# EAGLE board RectangularThing-SOICs-TWEAKS (EAGLE 7.7.0), part 1 of 2
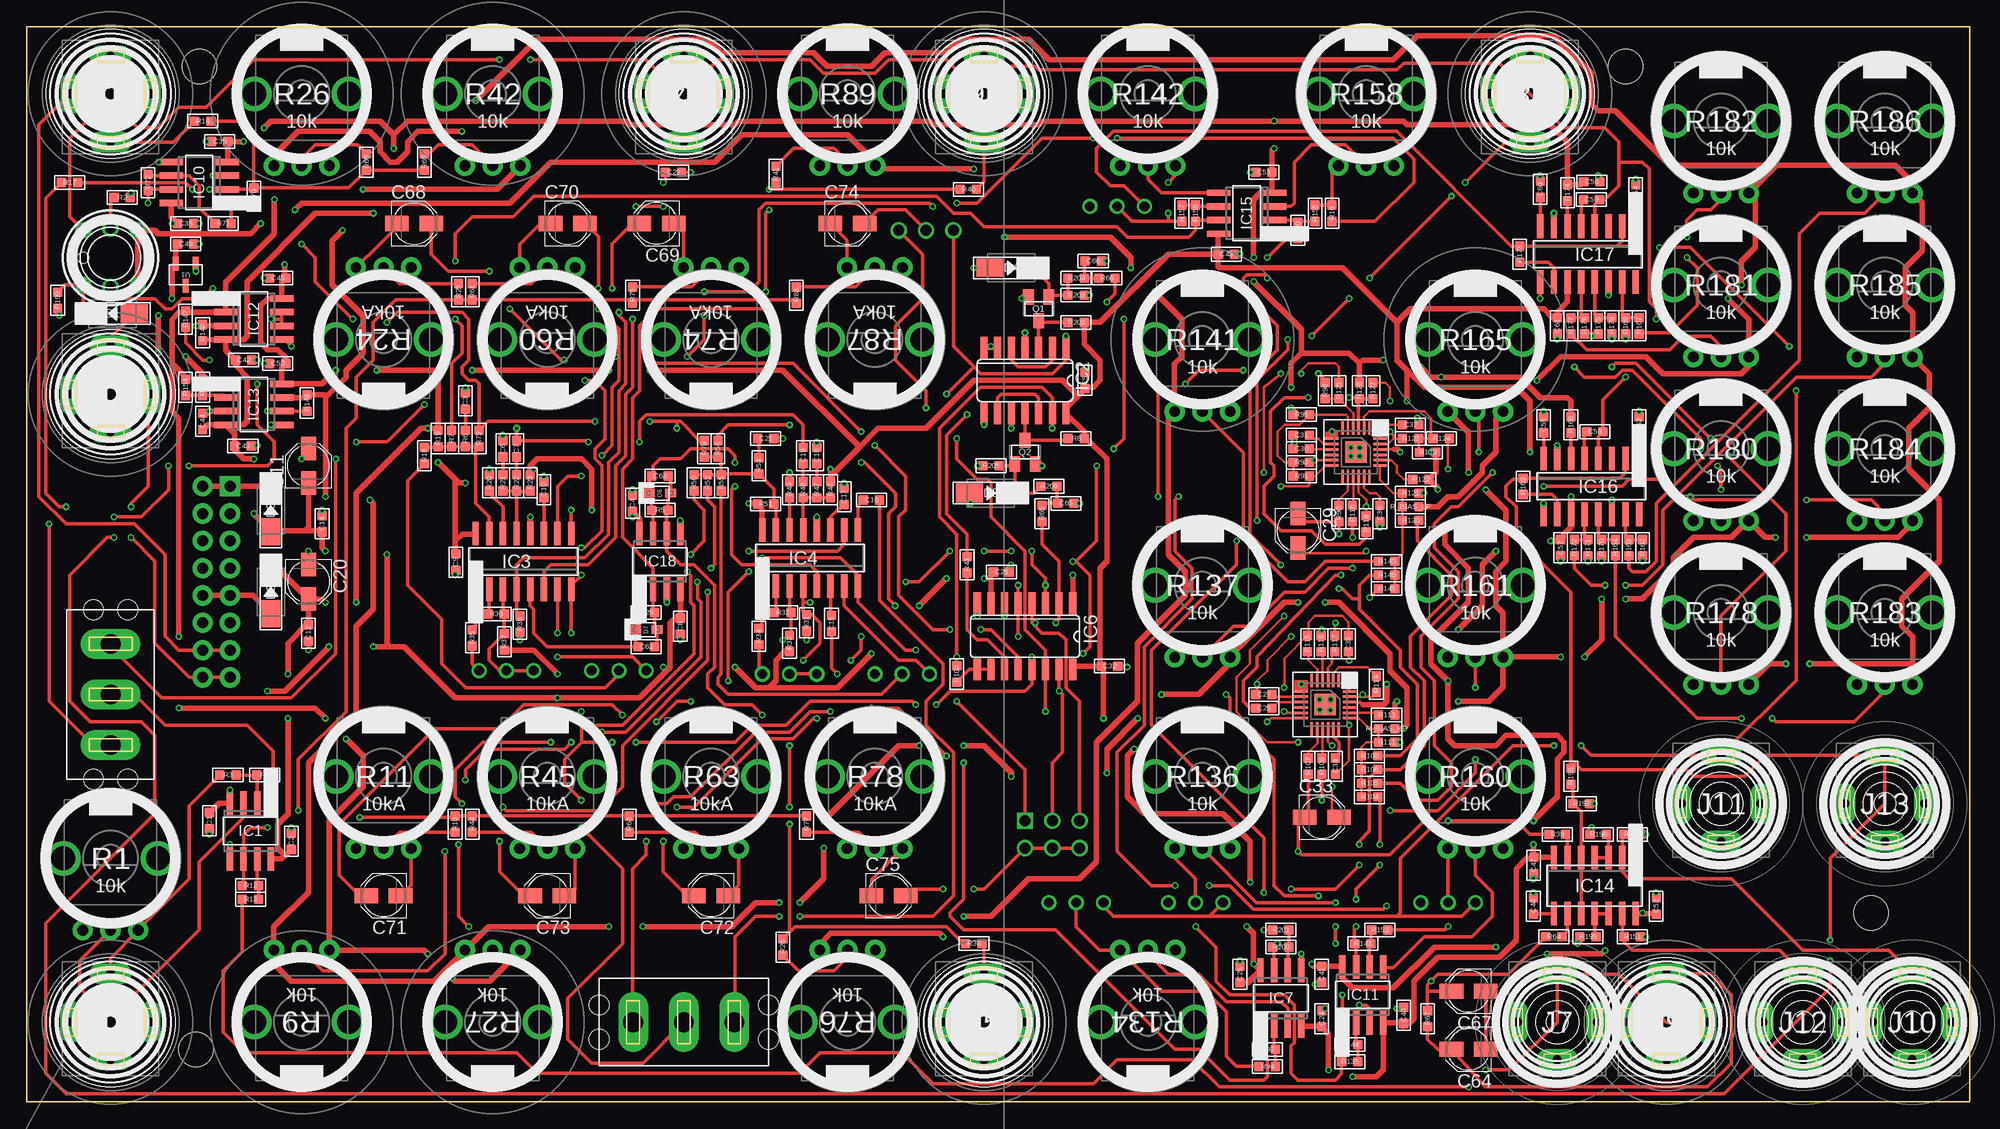
[diagram p10: board, top side]
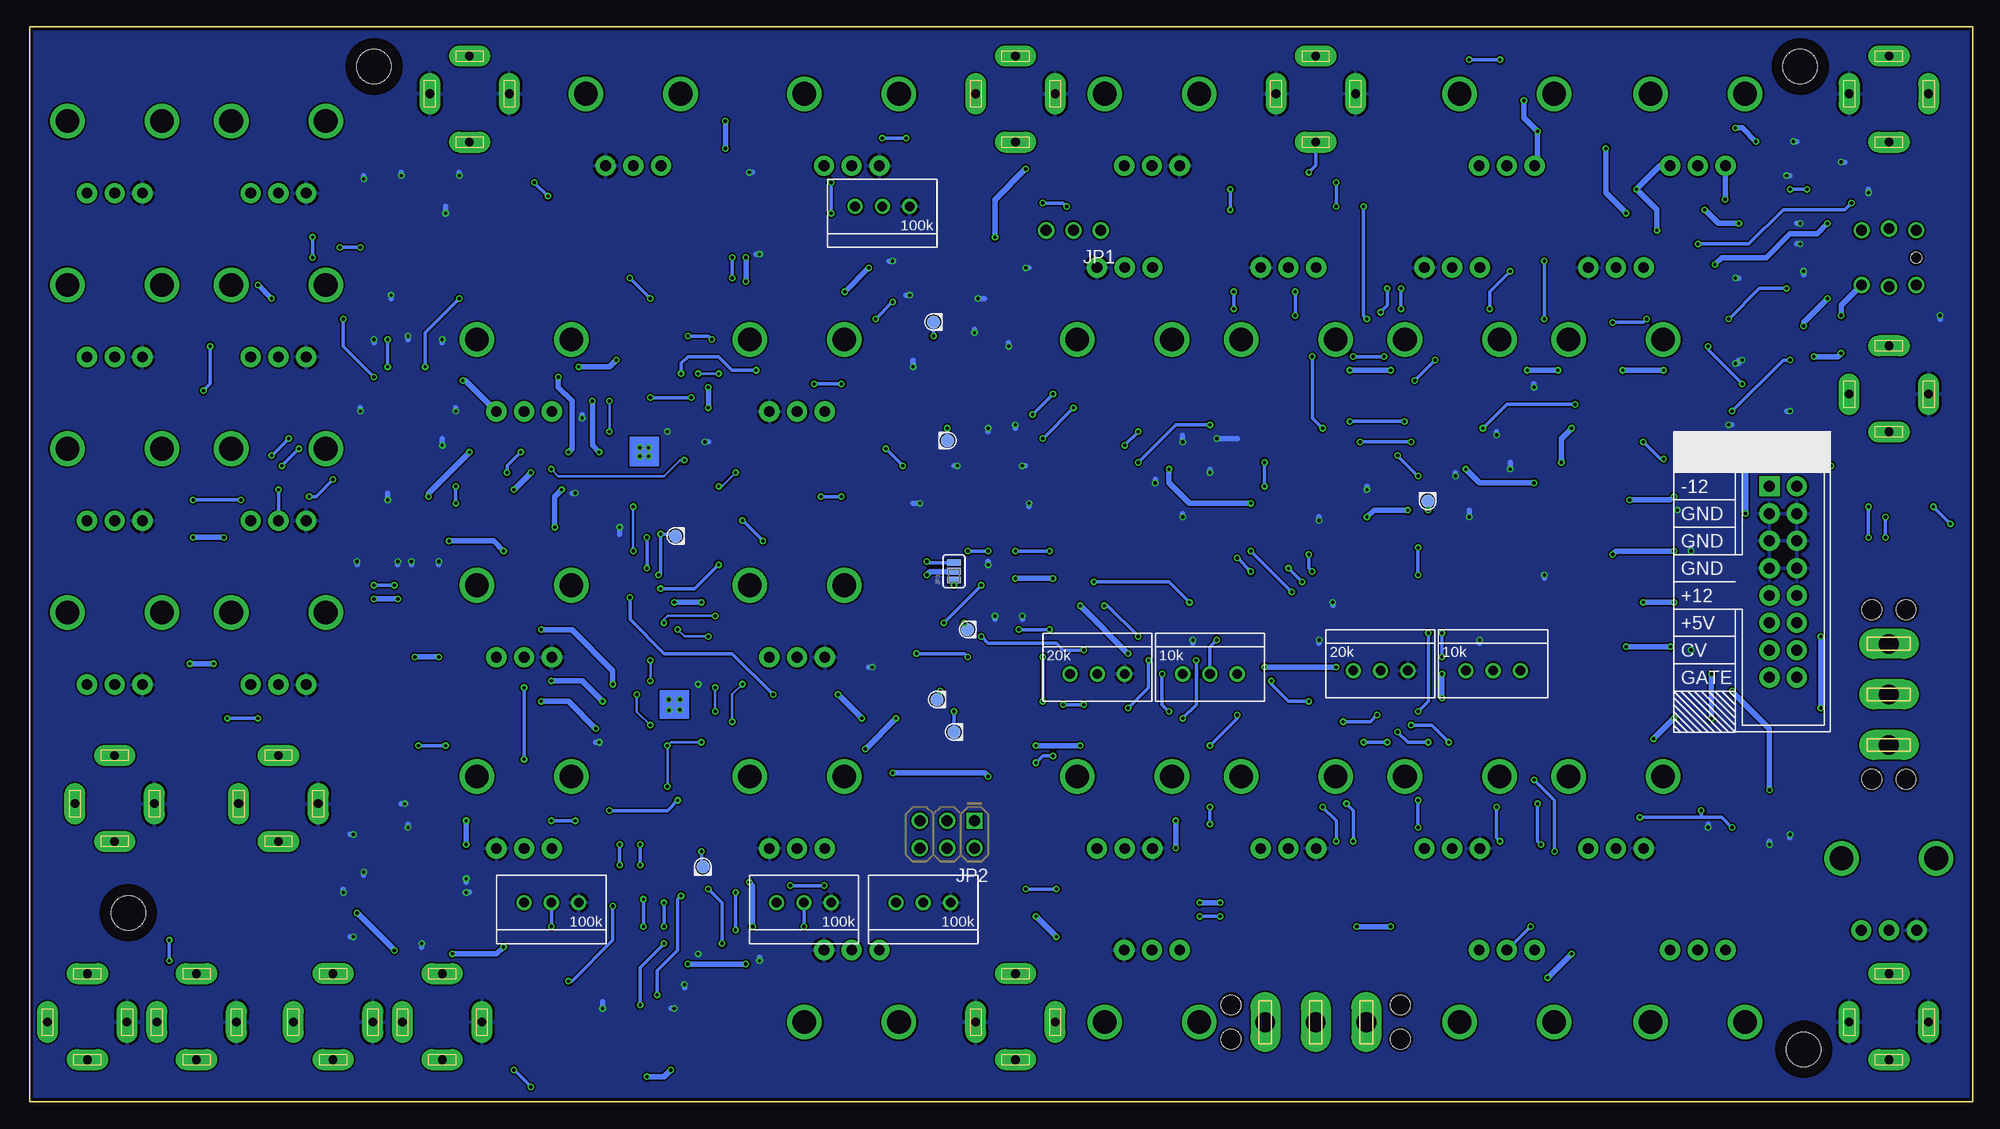
[diagram p11: board, bottom side, seen from below]

Size 180.78 x 100 mm. Coordinates in mm from the lower left corner, seen from the top.
Copper layers (1*16): Top 0.035mm / dielectric 1.5mm / Bottom 0.035mm
Design rules "ITEADstudio_DRC": minimum track width 6mil, minimum drill 12mil, track to track 6mil, track to pad 6mil, pad to pad 6mil, via to via 6mil, smd to smd 0mil, copper to edge 10mil, drill to drill 10mil, minimum pad ring 10mil, minimum via ring 6mil, stop-mask expansion 2mil, vias tented up to drill 100mil, thermal gap 10mil
Net classes: 0 default: width 0.305 mm; 1 power: width 0.508 mm; 2 nearfilter: width 0.254 mm; 3 groundplane: width 0.203 mm, clearance 0.203 mm

## Footprints (pad centres in the part's own frame; a part is rotated, then mirrored left to right if it is on the bottom)
C0603 = smd 0.889 x 0.889: 1 -0.762,0; 2 0.762,0
CASE_B = smd 2.2 x 1.4: + 1.6,0; - -1.6,0
DO-214AC = smd 2.5 x 1.7: 1 -2,0; 2 2,0
SOD-323F = smd 1 x 0.8: A -1,0; C 1,0
3.2-NOMARKINGS-SMALLSAFEZONE = hole 3.2: 0,0
SO08 = smd 0.6 x 2.2: 1 -1.905,-2.6; 2 -0.635,-2.6; 3 0.635,-2.6; 4 1.905,-2.6; 5 1.905,2.6; 6 0.635,2.6; 7 -0.635,2.6; 8 -1.905,2.6
SO14 = smd 0.66 x 2.032: 1 -3.81,-3.073; 2 -2.54,-3.073; 3 -1.27,-3.073; 4 0,-3.073; 5 1.27,-3.073; 6 2.54,-3.073; 7 3.81,-3.073; 8 3.81,3.073; 9 2.54,3.073; 10 1.27,3.073; 11 0,3.073; 12 -1.27,3.073; 13 -2.54,3.073; 14 -3.81,3.073
SO16 = smd 0.6 x 2.2: 1 -4.445,-2.6; 2 -3.175,-2.6; 3 -1.905,-2.6; 4 -0.635,-2.6; 5 0.635,-2.6; 6 1.905,-2.6; 7 3.175,-2.6; 8 4.445,-2.6; 9 4.445,2.6; 10 3.175,2.6; 11 1.905,2.6; 12 0.635,2.6; 13 -0.635,2.6; 14 -1.905,2.6; 15 -3.175,2.6; 16 -4.445,2.6
SO16' = smd 0.66 x 2.032: 1 -4.445,-3.073; 2 -3.175,-3.073; 3 -1.905,-3.073; 4 -0.635,-3.073; 5 0.635,-3.073; 6 1.905,-3.073; 7 3.175,-3.073; 8 4.445,-3.073; 9 4.445,3.073; 10 3.175,3.073; 11 1.905,3.073; 12 0.635,3.073; 13 -0.635,3.073; 14 -1.905,3.073; 15 -3.175,3.073; 16 -4.445,3.073
QFN24 = smd 1.25 x 0.23: P$1 -2.25,1.25; P$2 -2.25,0.75; P$3 -2.25,0.25; P$4 -2.25,-0.25; P$5 -2.25,-0.75; P$6 -2.25,-1.25; P$13 2.25,-1.25; P$14 2.25,-0.75; P$15 2.25,-0.25; P$16 2.25,0.25; P$17 2.25,0.75; P$18 2.25,1.25 | smd 0.23 x 1.25: P$7 -1.25,-2.25; P$8 -0.75,-2.25; P$9 -0.25,-2.25; P$10 0.25,-2.25; P$11 0.75,-2.25; P$12 1.25,-2.25; P$19 1.25,2.25; P$20 0.75,2.25; P$21 0.25,2.25; P$22 -0.25,2.25; P$23 -0.75,2.25; P$24 -1.25,2.25 | smd 2 x 2: PAD 0,0
SO14' = smd 0.6 x 2.2: 1 -3.81,-2.6; 2 -2.54,-2.6; 3 -1.27,-2.6; 4 0,-2.6; 5 1.27,-2.6; 6 2.54,-2.6; 7 3.81,-2.6; 8 3.81,2.6; 9 2.54,2.6; 10 1.27,2.6; 11 0,2.6; 12 -1.27,2.6; 13 -2.54,2.6; 14 -3.81,2.6
3.5MM-JACK-SWITCH-13MM-INPUT = drill 0.8 pad 1.93 long: RING@3 -3.7,0; SECOND@3 0,-3.5; SWITCH@3 3.7,0; TIP@3 0,4.5
3.5MM-JACK-SWITCH-13MM-OUTPUT = drill 0.8 pad 1.93 long: RING@3 -3.7,0; SECOND@3 0,-3.5; SWITCH@3 3.7,0; TIP@3 0,4.5
POWER_16_SHROUDED = drill 1.016 pad 1.88 square: 1 -8.89,-1.27 | drill 1.016 pad 1.88: 2 -8.89,1.27; 3 -6.35,-1.27; 4 -6.35,1.27; 5 -3.81,-1.27; 6 -3.81,1.27; 7 -1.27,-1.27; 8 -1.27,1.27; 9 1.27,-1.27; 10 1.27,1.27; 11 3.81,-1.27; 12 3.81,1.27; 13 6.35,-1.27; 14 6.35,1.27; 15 8.89,-1.27; 16 8.89,1.27
1X03_NO_SILK = drill 1.016: 1 0,0; 2 2.54,0; 3 5.08,0
2X3-NS = drill 1.016 square: 1 -2.54,-1.27 | drill 1.016: 2 -2.54,1.27; 3 0,-1.27; 4 0,1.27; 5 2.54,-1.27; 6 2.54,1.27
SJ_3_PASTE1&2 = smd 0.635 x 1.27: 1 -0.813,0; 2 0,0; 3 0.813,0
SOT23-BEC = smd 1 x 1.4: B -0.95,-1.1; C 0,1.1; E 0.95,-1.1
OG-POTS_ALPS_POT_VERTICAL = drill 1 pad 1.88: P$1 -2.58,-6.7; P$2 0,-6.7; P$3 2.58,-6.7 | drill 2.2 pad 3.175: P$4 4.4,0; P$5 -4.4,0
R0603 = smd 0.889 x 0.889: 1 -0.762,0; 2 0.762,0
OG-POTS_ALPS_POT_VERTICAL_WITHBIGKNOB = drill 1 pad 1.88: P$1 -2.58,-6.7; P$2 0,-6.7; P$3 2.58,-6.7 | drill 2.2 pad 3.175: P$4 4.4,0; P$5 -4.4,0
TRIMPOT = drill 0.9: P$1 -2.54,0; P$2 0,0; P$3 2.54,0
MULTICOMP1MS-ONOFFON = drill 1.85 long: 1 -4.7,0; 2 0,0; 3 4.7,0 | hole 1.85: -7.875,1.59; -7.875,-1.59; 7.875,1.59; 7.875,-1.59
PB6149L = drill 1: 1 2.54,2.54; 2 2.54,-2.54; 3 -2.54,2.54; 4 -2.54,-2.54; LEDNEG 0,-2.7; LEDPOS 0,2.7 | hole 1: 2.54,0
PAD.03X.05 = smd 1.27 x 1.27: P$1 0,0
SOT95P237X112-3N = smd 1.321 x 0.559: 1 -1.016,0.94; 2 -1.016,-0.94; 3 1.016,0

## Placement (x,y rotation side)
C1  100nF  [C0603]  17,26.15 270 top
C2  100nF  [C0603]  24.62,24.24 270 top
C3  10nF  [C0603]  40.81,65.2 270 top
C4  100nF  [C0603]  56.37,55.67 270 top
C5  100nF  [C0603]  98.47,67.1 90 top
C6  10nF  [C0603]  44.3,60.75 270 top
C7  100nF  [C0603]  45.57,60.75 90 top
C8  100nF  [C0603]  60.81,44.24 90 top
C9  100nF  [C0603]  39.92,50.21 90 top
C10  1nF C0G  [C0603]  48.11,56.94 90 top
C11  10u  [CASE_B]  26.2,59.17 90 top
C12  100nF  [C0603]  26.2,43.61 270 top
C14  100nF  [C0603]  27.47,53.77 90 top
C15  1nF C0G  [C0603]  74.88,44.5 270 top
C16  1nF C0G  [C0603]  78.59,55.99 180 top
C17  1nF C0G  [C0603]  76.05,56.31 90 top
C18  10nF  [C0603]  73.51,60.12 270 top
C19  100nF  [C0603]  72.24,60.12 90 top
C20  10u  [CASE_B]  26.2,48.37 270 top
C21  10nF  [C0603]  68.75,61.71 180 top
C23  1nF C0G  [C0603]  60.18,86.47 0 top
C24  100nF  [C0603]  120.5,7.73 90 top
C25  100nF  [C0603]  90.69,49.29 180 top
C26  300pF  [C0603]  115.1,36.62 0 top
C27  300pF  [C0603]  115.1,37.89 180 top
C28  100nF  [C0603]  112.88,11.86 270 top
C29  1uF  [CASE_B]  118.28,53.13 270 top
C30  300pF  [C0603]  118.6,60.75 0 top
C31  300pF  [C0603]  118.6,62.02 0 top
C32  100nF  [C0603]  100.75,40.53 0 top
C33  1uF  [CASE_B]  120.5,26.46 0 top
C34  300pF  [C0603]  121.77,31.23 270 top
C35  300pF  [C0603]  122.98,42.62 90 top
C36  300pF  [C0603]  125.9,54.72 270 top
C37  300pF  [C0603]  128.76,62.98 0 top
C38  100nF  [C0603]  14.77,81.71 180 top
C39  100nF  [C0603]  17.95,89.33 0 top
C40  100nF  [C0603]  128.12,8.05 90 top
C41  100nF  [C0603]  120.5,11.86 90 top
C42  100nF  [C0603]  20.17,69.01 0 top
C43  100nF  [C0603]  20.11,61.01 0 top
C44  100nF  [C0603]  16.36,63.29 90 top
C45  100nF  [C0603]  111.61,78.85 180 top
C46  5nF  [C0603]  140.19,18.21 90 top
C47  100nF  [C0603]  140.22,21.99 270 top
C48  100nF  [C0603]  23.35,76.63 0 top
C49  100nF  [C0603]  14.77,79.8 180 top
C50  100nF  [C0603]  23.35,68.69 0 top
C51  100nF  [C0603]  115.1,86.47 180 top
C52  100nF  [C0603]  151.62,18.21 270 top
C53  39nF  [C0603]  150.03,62.98 270 top
C54  39nF  [C0603]  149.71,84.57 270 top
C55  20nF  [C0603]  141.14,62.98 270 top
C56  10nF  [C0603]  145.9,62.34 180 top
C57  100nF  [C0603]  142.73,51.55 90 top
C58  100nF  [C0603]  145.61,85.58 180 top
C59  20nF  [C0603]  145.58,83.93 180 top
C60  20nF  [C0603]  140.82,84.88 270 top
C61  100nF  [C0603]  142.41,72.18 270 top
C62  10nF  [C0603]  57.64,42.34 0 top
C63  10nF  [C0603]  58.91,58.21 0 top
C64  10u  [CASE_B]  134.15,4.87 180 top
C65  33pF  [C0603]  96.69,55.67 180 top
C66  33pF  [C0603]  99.23,78.22 180 top
C67  10u  [CASE_B]  134.15,10.27 180 top
C68  10u  [CASE_B]  36.05,81.71 0 top
C69  10u  [CASE_B]  58.59,81.71 180 top
C70  10u  [CASE_B]  50.33,81.71 0 top
C71  10u  [CASE_B]  33.19,19.16 180 top
C72  10u  [CASE_B]  63.67,19.16 180 top
C73  10u  [CASE_B]  48.43,19.16 180 top
C74  10u  [CASE_B]  76.37,81.71 0 top
C75  10u  [CASE_B]  80.18,19.16 0 top
D1  1n4004  [DO-214AC]  7.98,73.33 180 top
D2  1n4004  [DO-214AC]  22.71,47.42 90 top
D3  1n4004  [DO-214AC]  22.71,55.04 90 top
D4  1n4004  [DO-214AC]  91.61,77.58 0 top
D5  1n4004  [DO-214AC]  89.7,56.63 0 top
D6  1n4004  [SOD-323F]  58.91,56.63 180 top
D7  1n4004  [SOD-323F]  57.64,43.93 180 top
H1  MOUNT-HOLE  [3.2-NOMARKINGS-SMALLSAFEZONE]  15.73,4.87 0 top
H2  MOUNT-HOLE  [3.2-NOMARKINGS-SMALLSAFEZONE]  16.04,96.31 0 top
H3  MOUNT-HOLE  [3.2-NOMARKINGS-SMALLSAFEZONE]  171.62,17.57 0 top
H4  MOUNT-HOLE  [3.2-NOMARKINGS-SMALLSAFEZONE]  148.76,96.31 0 top
IC1  TL072  [SO08]  20.81,25.19 180 top
IC2  4013D  [SO14]  92.88,67.1 180 top
IC3  CEM3340SOIC16  [SO16]  46.21,50.28 0 top
IC4  CEM3340SOIC16  [SO16]  72.88,50.59 0 top
IC6  4053D  [SO16']  92.88,43.29 180 top
IC7  TL072  [SO08]  116.69,9.64 0 top
IC8  CEM3320_UNFOLDEDQFN  [QFN24]  120.82,36.94 270 top
IC9  CEM3320QFN24  [QFN24]  123.68,60.44 270 top
IC10  TL072  [SO08]  16.04,85.52 90 top
IC11  TL072  [SO08]  124.31,9.95 0 top
IC12  TL072  [SO08]  21.12,72.82 270 top
IC13  TL072  [SO08]  21.12,64.88 270 top
IC14  CEM3360SOIC14  [SO14']  145.9,20.11 180 top
IC15  TL072  [SO08]  113.52,82.66 90 top
IC16  CEM3310SOIC16  [SO16]  145.58,57.26 180 top
IC17  CEM3310SOIC16  [SO16]  145.27,78.85 180 top
IC18  TL072  [SO08]  58.91,50.28 0 top
J1  PJ-341  [3.5MM-JACK-SWITCH-13MM-INPUT]  7.79,7.41 0 top
J2  PJ-341  [3.5MM-JACK-SWITCH-13MM-INPUT]  7.79,65.83 0 top
J3  PJ-341  [3.5MM-JACK-SWITCH-13MM-INPUT]  7.79,93.77 180 top
J4  PJ-341  [3.5MM-JACK-SWITCH-13MM-INPUT]  61.13,93.77 180 top
J5  PJ-341  [3.5MM-JACK-SWITCH-13MM-INPUT]  89.07,7.41 0 top
J6  PJ-341  [3.5MM-JACK-SWITCH-13MM-INPUT]  89.07,93.77 180 top
J7  PJ-341  [3.5MM-JACK-SWITCH-13MM-OUTPUT]  142.41,7.41 0 top
J8  PJ-341  [3.5MM-JACK-SWITCH-13MM-INPUT]  139.87,93.77 180 top
J9  PJ-341  [3.5MM-JACK-SWITCH-13MM-INPUT]  152.57,7.41 0 top
J10  PJ-341  [3.5MM-JACK-SWITCH-13MM-OUTPUT]  175.43,7.41 0 top
J11  PJ-341  [3.5MM-JACK-SWITCH-13MM-OUTPUT]  157.65,27.73 0 top
J12  PJ-341  [3.5MM-JACK-SWITCH-13MM-OUTPUT]  165.27,7.41 0 top
J13  PJ-341  [3.5MM-JACK-SWITCH-13MM-OUTPUT]  172.89,27.73 0 top
J14  POWERSHROUDED  [POWER_16_SHROUDED]  17.63,48.37 270 bottom
JP1  1x3pin header  [1X03_NO_SILK]  81.13,81.07 180 bottom
JP2  2x3pin header  [2X3-NS]  95.42,24.88 180 bottom
JP3  JUMPER-31-2  [SJ_3_PASTE1&2]  94.78,49.36 90 bottom
PCB1  EURORACK_PCB36HP_10CM  [EURORACK36HP]  -0.34,-3 0 top
Q1  MMBT3904  [SOT23-BEC]  94.15,73.77 180 top
Q2  MMBT3904  [SOT23-BEC]  92.88,60.44 0 top
R1  10k  [OG-POTS_ALPS_POT_VERTICAL]  7.79,22.65 0 top
R2  1k  [R0603]  8.87,84.12 0 top
R3  22k  [R0603]  18.71,30.4 0 top
R4  22k  [R0603]  22.14,30.4 0 top
R5  100k  [R0603]  58.91,55.04 0 top
R6  470  [R0603]  40.81,61.71 90 top
R7  100k  [R0603]  39.54,61.71 270 top
R8  68k  [R0603]  97.64,61.71 0 top
R9  10k  [OG-POTS_ALPS_POT_VERTICAL_WITHBIGKNOB]  25.57,7.41 180 top
R10  100k  [R0603]  39.86,25.83 90 top
R11  10kA  [OG-POTS_ALPS_POT_VERTICAL]  33.19,30.27 0 top
R12  100k  [R0603]  20.81,20.11 0 top
R13  100  [R0603]  20.81,18.84 180 top
R14  100k  [R0603]  16.36,91.23 0 top
R16  100  [R0603]  121.45,82.66 90 top
R17  100k  [R0603]  3.98,85.52 0 top
R18  1M  [R0603]  37,60.12 270 top
R19  360k  [R0603]  38.27,61.71 270 top
R20  1.8k  [R0603]  43.03,57.58 270 top
R21  470  [R0603]  44.3,57.58 90 top
R22  1M  [R0603]  45.57,57.58 270 top
R23  1.5M  [R0603]  46.84,57.58 270 top
R24  10kA  [OG-POTS_ALPS_POT_VERTICAL]  33.19,70.91 180 top
R25  100k  [R0603]  40.17,75.36 270 top
R26  10k  [OG-POTS_ALPS_POT_VERTICAL_WITHBIGKNOB]  25.57,93.77 0 top
R27  10k  [OG-POTS_ALPS_POT_VERTICAL_WITHBIGKNOB]  43.35,7.41 180 top
R28  100k  [R0603]  70.34,14.4 270 top
R29  100k  [R0603]  57.64,45.51 180 top
R30  100k  [R0603]  88.12,14.72 180 top
R31  10k  [R0603]  72.56,44.56 270 top
R32  820  [R0603]  70.97,42.66 270 top
R33  5.6k  [R0603]  70.34,45.51 0 top
R34  24k  [R0603]  68.11,43.29 270 top
R35  24k  [R0603]  41.44,43.16 270 top
R36  5.6k  [R0603]  43.67,45.39 0 top
R37  820  [R0603]  44.43,42.78 270 top
R38  10k  [R0603]  45.89,44.43 270 top
R39  47k  [R0603]  142.41,24.88 0 top
R40  100k  [R0603]  87.61,84.88 180 top
R41  100k  [R0603]  69.7,86.28 90 top
R42  10k  [OG-POTS_ALPS_POT_VERTICAL_WITHBIGKNOB]  43.35,93.77 0 top
R43  100k  [R0603]  87.48,49.96 90 top
R44  100k  [R0603]  41.44,25.83 90 top
R45  10kA  [OG-POTS_ALPS_POT_VERTICAL]  48.43,30.27 0 top
R46  1.5M  [R0603]  74.78,56.94 270 top
R47  470  [R0603]  73.51,56.94 90 top
R48  1M  [R0603]  72.24,56.94 270 top
R49  1.8k  [R0603]  70.97,56.94 270 top
R50  100k  [R0603]  62.08,57.58 90 top
R51  360k  [R0603]  68.75,55.61 0 top
R52  1M  [R0603]  63.35,57.58 90 top
R54  470  [R0603]  68.11,59.17 90 top
R55  1M  [R0603]  64.62,57.58 270 top
R56  100k  [R0603]  64.3,60.75 270 top
R60  10kA  [OG-POTS_ALPS_POT_VERTICAL]  48.43,70.91 180 top
R61  100k  [R0603]  41.44,75.36 270 top
R62  100k  [R0603]  56.05,25.83 90 top
R63  10kA  [OG-POTS_ALPS_POT_VERTICAL]  63.67,30.27 0 top
R64  47k  [R0603]  142.09,15.35 180 top
R65  10k  [R0603]  94.47,54.72 270 top
R66  10k  [R0603]  100.5,76.63 0 top
R67  0  [R0603]  130.34,7.73 90 top
R68  1M  [R0603]  31.6,87.42 270 top
R69  100k  [R0603]  37,87.42 270 top
R70  100k  [R0603]  21.12,84.25 270 top
R71  100k  [R0603]  18.27,81.71 180 top
R72  100k  [R0603]  11.28,85.52 270 top
R73  100k 0.1%  [R0603]  42.08,61.71 270 top
R74  10kA  [OG-POTS_ALPS_POT_VERTICAL]  63.67,70.91 180 top
R75  100k  [R0603]  56.37,75.04 270 top
R76  10k  [OG-POTS_ALPS_POT_VERTICAL]  76.37,7.41 180 top
R77  100k  [R0603]  72.56,25.83 90 top
R78  10kA  [OG-POTS_ALPS_POT_VERTICAL]  78.91,30.27 0 top
R79  100k 0.1%  [R0603]  63.03,60.75 270 top
R87  10kA  [OG-POTS_ALPS_POT_VERTICAL]  78.91,70.91 180 top
R88  100k  [R0603]  71.61,75.04 270 top
R89  10k  [OG-POTS_ALPS_POT_VERTICAL]  76.37,93.77 0 top
R90  51.1k  [R0603]  122.09,54.72 90 top
R91  91k  [R0603]  118.6,58.21 0 top
R92  22k  [R0603]  115.42,4.87 180 top
R93  100k  [R0603]  118.6,59.48 0 top
R94  22k  [R0603]  115.42,3.29 0 top
R95  220k  [R0603]  118.6,63.93 0 top
R96  91k  [R0603]  120.82,66.15 90 top
R103  100k  [R0603]  86.53,39.8 90 top
R104  51.1k  [R0603]  124.95,28.37 180 top
R105  100k  [R0603]  124.95,29.64 180 top
R106  100k  [R0603]  124.95,30.91 180 top
R107  51.1k  [R0603]  119.23,31.23 90 top
R108  100k  [R0603]  120.5,31.23 270 top
R109  100k  [R0603]  124.95,32.18 180 top
R111  1.8k  [R0603]  126.53,33.45 0 top
R113  1.8k  [R0603]  126.53,35.99 0 top
R114  100k  [R0603]  125.58,38.85 270 top
R115  100k  [R0603]  119.17,42.62 90 top
R116  100k  [R0603]  120.44,42.62 90 top
R117  100k  [R0603]  121.71,42.62 90 top
R118  100k  [R0603]  123.36,54.72 270 top
R119  100k  [R0603]  124.63,53.77 270 top
R120  100k  [R0603]  128.76,54.09 180 top
R121  1.8k  [R0603]  128.76,56.63 0 top
R122  1.8k  [R0603]  129.71,57.9 180 top
R123  100k  [R0603]  128.76,61.71 0 top
R124  91k  [R0603]  131.61,61.71 180 top
R125  100k  [R0603]  122.09,66.15 90 top
R126  220k  [R0603]  123.99,66.15 90 top
R127  91k  [R0603]  125.26,66.15 270 top
R134  10k  [OG-POTS_ALPS_POT_VERTICAL]  104.31,7.41 180 top
R135  22k  [R0603]  123.1,3.73 0 top
R136  10k  [OG-POTS_ALPS_POT_VERTICAL]  109.39,30.27 0 top
R137  10k  [OG-POTS_ALPS_POT_VERTICAL]  109.39,48.05 0 top
R139  220k  [R0603]  130.34,60.44 0 top
R140  100k  [R0603]  126.53,50.28 0 top
R141  10k  [OG-POTS_ALPS_POT_VERTICAL_WITHBIGKNOB]  109.39,70.91 0 top
R142  10k  [OG-POTS_ALPS_POT_VERTICAL]  104.31,93.77 0 top
R143  22k  [R0603]  124.31,14.72 180 top
R144  22k  [R0603]  123.1,5.32 180 top
R145  51.1k  [R0603]  126.53,47.74 0 top
R146  100k  [R0603]  126.53,49.01 0 top
R147  100k  [R0603]  14.77,72.82 270 top
R148  10k  [R0603]  16.36,71.55 90 top
R149  100k  [R0603]  26.08,65.01 90 top
R150  22k  [R0603]  118.28,81.07 270 top
R151  47k  [R0603]  149.39,15.35 0 top
R152  22k  [R0603]  125.9,15.99 180 top
R153  200k  [R0603]  16.36,66.47 90 top
R154  100k  [R0603]  14.77,66.47 270 top
R155  22k  [R0603]  119.87,82.66 270 top
R156  22k  [R0603]  108.75,82.66 270 top
R157  22k  [R0603]  107.48,82.66 90 top
R158  10k  [OG-POTS_ALPS_POT_VERTICAL]  124.63,93.77 0 top
R159  47k  [R0603]  149.39,24.88 0 top
R160  10k  [OG-POTS_ALPS_POT_VERTICAL]  134.79,30.27 0 top
R161  10k  [OG-POTS_ALPS_POT_VERTICAL]  134.79,48.05 0 top
R162  470  [R0603]  150.35,51.55 270 top
R163  10k  [R0603]  149.08,51.55 270 top
R164  10k  [R0603]  147.81,51.55 270 top
R165  10k  [OG-POTS_ALPS_POT_VERTICAL_WITHBIGKNOB]  134.79,70.91 0 top
R166  470  [R0603]  148.76,72.18 270 top
R167  10k  [R0603]  150.03,72.18 270 top
R168  470  [R0603]  143.68,62.98 90 top
R169  24k  [R0603]  139.23,57.26 90 top
R170  470  [R0603]  146.54,51.55 270 top
R171  470  [R0603]  145.27,51.55 90 top
R172  10k  [R0603]  144,51.55 270 top
R173  24k  [R0603]  138.92,78.85 90 top
R174  470  [R0603]  143.36,84.57 90 top
R175  470  [R0603]  146.22,72.18 270 top
R176  470  [R0603]  144.95,72.18 90 top
R177  10k  [R0603]  143.68,72.18 270 top
R178  10k  [OG-POTS_ALPS_POT_VERTICAL]  157.65,45.51 0 top
R179  10k  [R0603]  147.49,72.18 270 top
R180  10k  [OG-POTS_ALPS_POT_VERTICAL]  157.65,60.75 0 top
R181  10k  [OG-POTS_ALPS_POT_VERTICAL]  157.65,75.99 0 top
R182  10k  [OG-POTS_ALPS_POT_VERTICAL]  157.65,91.23 0 top
R183  10k  [OG-POTS_ALPS_POT_VERTICAL]  172.89,45.51 0 top
R184  10k  [OG-POTS_ALPS_POT_VERTICAL]  172.89,60.75 0 top
R185  10k  [OG-POTS_ALPS_POT_VERTICAL]  172.89,75.99 0 top
R186  10k  [OG-POTS_ALPS_POT_VERTICAL]  172.89,91.23 0 top
R187  10k  [TRIMPOT]  70.97,39.8 0 bottom
R188  20k  [TRIMPOT]  55.1,40.12 0 bottom
R189  20k  [TRIMPOT]  81.45,39.8 0 bottom
R190  10k  [TRIMPOT]  44.62,40.12 0 bottom
R191  100k  [TRIMPOT]  97.64,18.53 180 bottom
R192  100k  [TRIMPOT]  108.75,18.53 180 bottom
R193  100k  [TRIMPOT]  101.45,83.3 180 bottom
R194  100k  [TRIMPOT]  132.25,18.53 180 bottom
R195  4M7  [R0603]  145.27,15.35 180 top
R196  4M7  [R0603]  146.22,24.88 0 top
R197  10k  [R0603]  144.63,27.73 0 top
R198  15k  [R0603]  143.68,30.27 270 top
R199  22k  [R0603]  2.87,74.57 270 top
R200  100k  [R0603]  116.69,14.4 180 top
R201  100k  [R0603]  116.69,15.99 0 top
R202  68k  [R0603]  97.64,72.5 0 top
R203  33k  [R0603]  97.64,75.04 180 top
R204  220k  [R0603]  97.64,76.63 0 top
R205  33k  [R0603]  89.7,59.17 0 top
R206  220k  [R0603]  95.1,57.26 0 top
R_BIAS_HP  200k  [R0603]  126.53,34.72 0 top
R_BIAS_LP  BIAS DNP  [R0603]  128.76,55.36 180 top
S1  ONOFFON  [MULTICOMP1MS-ONOFFON]  7.79,37.89 270 top
S2  SWITCH_W_LED_PB6149L-X-102YELLOW  [PB6149L]  7.79,78.53 180 top
S3  ONOFFON  [MULTICOMP1MS-ONOFFON]  61.13,7.41 180 top
TP1  TEST-POINT3X5  [PAD.03X.05]  95.39,61.52 90 bottom
TP2  TEST-POINT3X5  [PAD.03X.05]  96.69,72.53 270 bottom
TP3  TEST-POINT3X5  [PAD.03X.05]  50.7,55.87 0 bottom
TP4  TEST-POINT3X5  [PAD.03X.05]  96.37,37.42 270 bottom
TP5  TEST-POINT3X5  [PAD.03X.05]  94.78,34.4 270 bottom
TP6  TEST-POINT3X5  [PAD.03X.05]  93.51,43.93 270 bottom
TP7  TEST-POINT3X5  [PAD.03X.05]  118.15,21.86 180 bottom
TP8  TEST-POINT3X5  [PAD.03X.05]  120.69,52.63 270 bottom
U1  LM4040DIM3-5.0  [SOT95P237X112-3N]  14.77,76.95 270 top